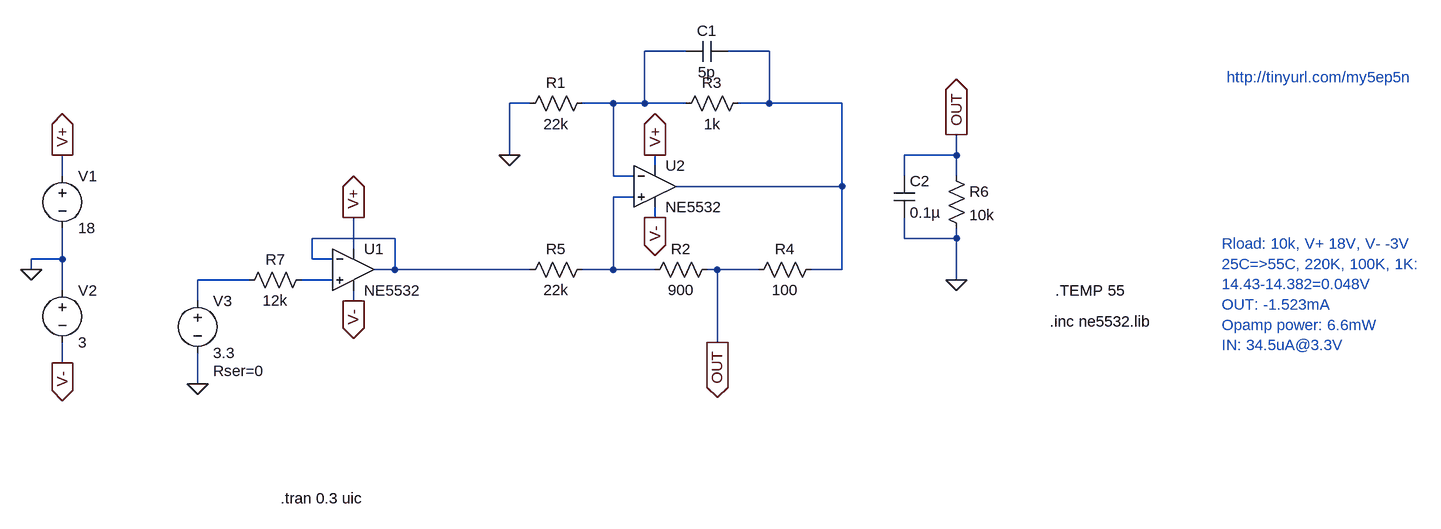
[diagram p0: schematic current_pump.asc]
current_pump.asc, the LTspice schematic file:
Version 4
SHEET 1 1412 680
WIRE 256 -96 192 -96
WIRE 384 -96 320 -96
WIRE 16 -16 -16 -16
WIRE 144 -16 96 -16
WIRE 192 -16 192 -96
WIRE 192 -16 144 -16
WIRE 256 -16 192 -16
WIRE 384 -16 384 -96
WIRE 384 -16 336 -16
WIRE 496 -16 384 -16
WIRE -16 64 -16 -16
WIRE 672 64 672 32
WIRE 672 64 592 64
WIRE 208 80 208 64
WIRE -704 96 -704 64
WIRE 144 96 144 -16
WIRE 176 96 144 96
WIRE 592 96 592 64
WIRE 672 96 672 64
WIRE 496 112 496 -16
WIRE 496 112 240 112
WIRE 176 128 144 128
WIRE 208 160 208 144
WIRE -192 192 -320 192
WIRE 592 192 592 160
WIRE 672 192 672 176
WIRE 672 192 592 192
WIRE -256 208 -256 160
WIRE -704 224 -704 176
WIRE -704 224 -752 224
WIRE -320 224 -320 192
WIRE -288 224 -320 224
WIRE -752 240 -752 224
WIRE -192 240 -192 192
WIRE -192 240 -224 240
WIRE 16 240 -192 240
WIRE 144 240 144 128
WIRE 144 240 96 240
WIRE 208 240 144 240
WIRE 304 240 288 240
WIRE 368 240 304 240
WIRE 496 240 496 112
WIRE 496 240 448 240
WIRE -416 256 -496 256
WIRE -288 256 -336 256
WIRE 672 256 672 192
WIRE -704 272 -704 224
WIRE -496 288 -496 256
WIRE -256 288 -256 272
WIRE 304 352 304 240
WIRE -704 384 -704 352
WIRE -496 416 -496 368
FLAG -752 240 0
FLAG -704 384 V-
IOPIN -704 384 Out
FLAG -704 64 V+
IOPIN -704 64 Out
FLAG 208 64 V+
IOPIN 208 64 Out
FLAG 208 160 V-
IOPIN 208 160 Out
FLAG -16 64 0
FLAG 304 352 OUT
IOPIN 304 352 Out
FLAG 672 32 OUT
IOPIN 672 32 Out
FLAG 672 256 0
FLAG -496 416 0
FLAG -256 160 V+
IOPIN -256 160 Out
FLAG -256 288 V-
IOPIN -256 288 Out
SYMBOL res 112 -32 R90
WINDOW 0 0 56 VBottom 2
WINDOW 3 32 56 VTop 2
SYMATTR InstName R1
SYMATTR Value 22k
SYMBOL res 304 224 R90
WINDOW 0 0 56 VBottom 2
WINDOW 3 32 56 VTop 2
SYMATTR InstName R2
SYMATTR Value 900
SYMBOL res 352 -32 R90
WINDOW 0 0 56 VBottom 2
WINDOW 3 32 56 VTop 2
SYMATTR InstName R3
SYMATTR Value 1k
SYMBOL res 464 224 R90
WINDOW 0 0 56 VBottom 2
WINDOW 3 32 56 VTop 2
SYMATTR InstName R4
SYMATTR Value 100
SYMBOL res 112 224 R90
WINDOW 0 0 56 VBottom 2
WINDOW 3 32 56 VTop 2
SYMATTR InstName R5
SYMATTR Value 22k
SYMBOL cap 320 -112 R90
WINDOW 0 0 32 VBottom 2
WINDOW 3 32 32 VTop 2
SYMATTR InstName C1
SYMATTR Value 5p
SYMBOL voltage -704 80 R0
WINDOW 123 0 0 Left 2
WINDOW 39 0 0 Left 2
SYMATTR InstName V1
SYMATTR Value 18
SYMBOL voltage -704 256 R0
WINDOW 123 0 0 Left 2
WINDOW 39 0 0 Left 2
SYMATTR InstName V2
SYMATTR Value 3
SYMBOL voltage -496 272 R0
WINDOW 123 0 0 Left 2
WINDOW 39 24 124 Left 2
SYMATTR SpiceLine Rser=0
SYMATTR InstName V3
SYMATTR Value 3.3
SYMBOL res 656 80 R0
SYMATTR InstName R6
SYMATTR Value 10k
SYMBOL cap 576 96 R0
SYMATTR InstName C2
SYMATTR Value 0.1µ
SYMBOL Opamps\\opamp2 208 48 R0
SYMATTR InstName U2
SYMATTR Value NE5532
SYMBOL res -320 240 R90
WINDOW 0 0 56 VBottom 2
WINDOW 3 32 56 VTop 2
SYMATTR InstName R7
SYMATTR Value 12k
SYMBOL Opamps\\opamp2 -256 176 R0
SYMATTR InstName U1
SYMATTR Value NE5532
TEXT -368 592 Left 2 !.tran 0.3 uic
TEXT 816 320 Left 2 !.inc ne5532.lib
TEXT 824 272 Left 2 !.TEMP 55
TEXT 1080 200 Left 2 ;Rload: 10k, V+ 18V, V- -3V\n25C=>55C, 220K, 100K, 1K:\n14.43-14.382=0.048V\nOUT: -1.523mA\nOpamp power: 6.6mW\nIN: 34.5uA@3.3V
TEXT 1088 -56 Left 2 ;http://tinyurl.com/my5ep5n

The netlist it stands for:
* current_pump.asc
R1 N001 0 22k
R2 OUT N003 900
R3 N002 N001 1k
R4 N002 OUT 100
R5 N003 N004 22k
C1 N002 N001 5p
V1 V+ 0 18
V2 0 V- 3
V3 N005 0 3.3 Rser=0
R6 OUT 0 10k
C2 OUT 0 0.1µ
XU2 N003 N001 V+ V- N002 NE5532  ; pins In+ In- V+ V- OUT
R7 N006 N005 12k
XU1 N006 N004 V+ V- N004 NE5532  ; pins In+ In- V+ V- OUT
.tran 0.3 uic
.inc ne5532.lib
.TEMP 55
* Rload: 10k, V+ 18V, V- -3V
* 25C=>55C, 220K, 100K, 1K:
* 14.43-14.382=0.048V
* OUT: -1.523mA
* Opamp power: 6.6mW
* IN: 34.5uA@3.3V
* http://tinyurl.com/my5ep5n
.backanno
.end